# Altium schematic sheet IGNITERS.SchDoc
size 297 x 281 mm; SheetNumber: 6; SheetTotal: 6
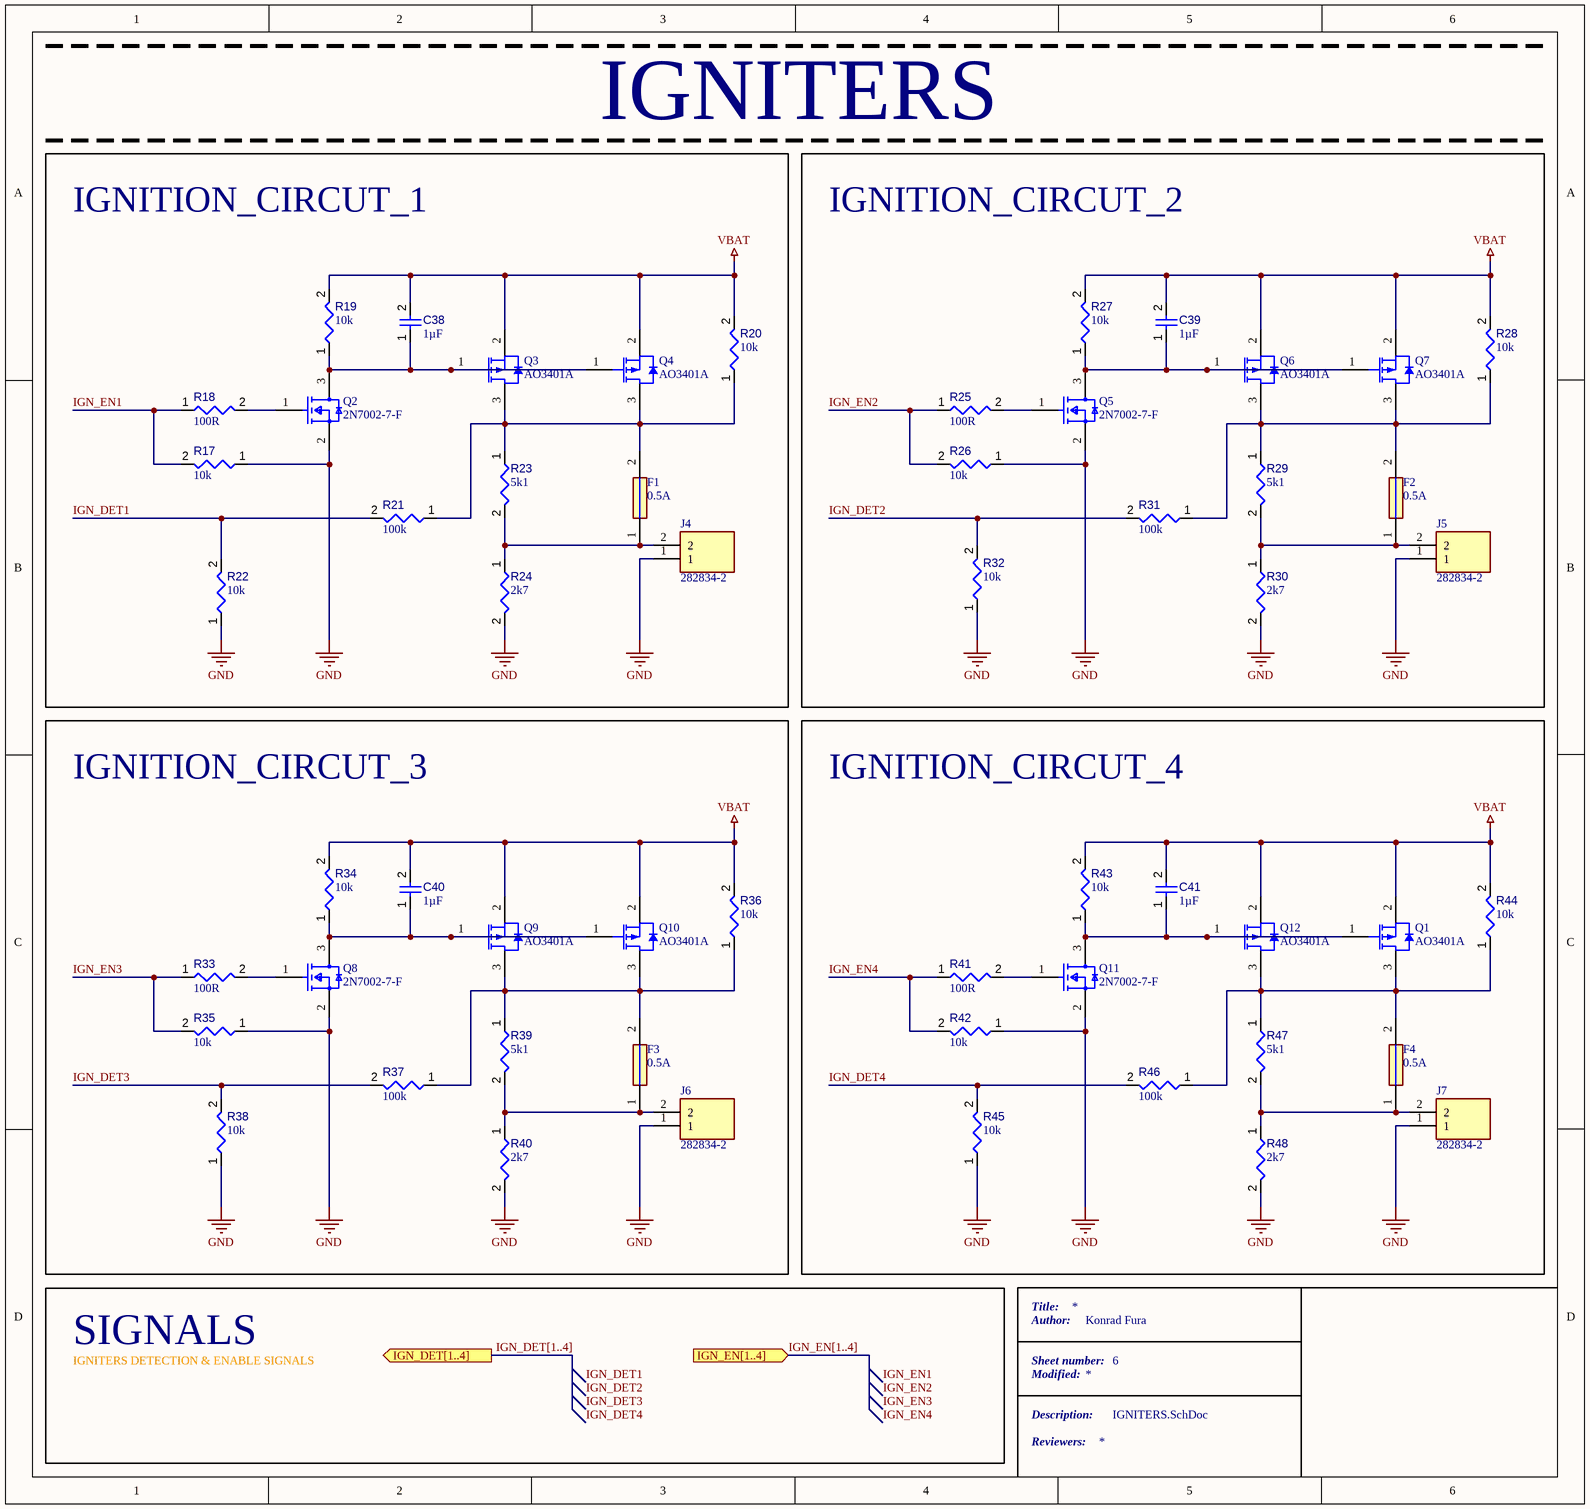
[diagram p0: IGNITERS.SchDoc]

## Parts
C38  value 1µF  [CAPC0402(1005)60_L]  (hidden comment: Capacitor 1µF +/-20% 10V 0402)
C39  value 1µF  [CAPC0402(1005)60_L]  (hidden comment: Capacitor 1µF +/-20% 10V 0402)
C40  value 1µF  [CAPC0402(1005)60_L]  (hidden comment: Capacitor 1µF +/-20% 10V 0402)
C41  value 1µF  [CAPC0402(1005)60_L]  (hidden comment: Capacitor 1µF +/-20% 10V 0402)
F1  0.5A  [FUSC2114X75N]
F2  0.5A  [FUSC2114X75N]
F3  0.5A  [FUSC2114X75N]
F4  0.5A  [FUSC2114X75N]
J4  282834-2  [282834-2_1]
J5  282834-2  [282834-2_1]
J6  282834-2  [282834-2_1]
J7  282834-2  [282834-2_1]
Q1  AO3401A  [AO-SOT-23-3L_V]
Q2  2N7002-7-F  [FP-SOT23-MFG]
Q3  AO3401A  [AO-SOT-23-3L_V]
Q4  AO3401A  [AO-SOT-23-3L_V]
Q5  2N7002-7-F  [FP-SOT23-MFG]
Q6  AO3401A  [AO-SOT-23-3L_V]
Q7  AO3401A  [AO-SOT-23-3L_V]
Q8  2N7002-7-F  [FP-SOT23-MFG]
Q9  AO3401A  [AO-SOT-23-3L_V]
Q10  AO3401A  [AO-SOT-23-3L_V]
Q11  2N7002-7-F  [FP-SOT23-MFG]
Q12  AO3401A  [AO-SOT-23-3L_V]
R17  value 10k  [RESC0402(1005)_L]  (hidden comment: Resistor 10K  +/-1 % 0402 63 mW)
R18  value 100R  [RESC0402(1005)_L]  (hidden comment: Resistor 100R +/-1 % 0402 63 mW)
R19  value 10k  [RESC0402(1005)_L]  (hidden comment: Resistor 10K  +/-1 % 0402 63 mW)
R20  value 10k  [RESC0402(1005)_L]  (hidden comment: Resistor 10K  +/-1 % 0402 63 mW)
R21  value 100k  [RESC0402(1005)_L]  (hidden comment: Resistor 100K +/-1 % 0402 63 mW)
R22  value 10k  [RESC0402(1005)_L]  (hidden comment: Resistor 10K  +/-1 % 0402 63 mW)
R23  value 5k1  [RESC0402(1005)_L]  (hidden comment: Resistor 5.1K +/-1 % 0402 63 mW)
R24  value 2k7  [RESC0402(1005)_L]  (hidden comment: Resistor 2.7K +/-1 % 0402 63 mW)
R25  value 100R  [RESC0402(1005)_L]  (hidden comment: Resistor 100R +/-1 % 0402 63 mW)
R26  value 10k  [RESC0402(1005)_L]  (hidden comment: Resistor 10K  +/-1 % 0402 63 mW)
R27  value 10k  [RESC0402(1005)_L]  (hidden comment: Resistor 10K  +/-1 % 0402 63 mW)
R28  value 10k  [RESC0402(1005)_L]  (hidden comment: Resistor 10K  +/-1 % 0402 63 mW)
R29  value 5k1  [RESC0402(1005)_L]  (hidden comment: Resistor 5.1K +/-1 % 0402 63 mW)
R30  value 2k7  [RESC0402(1005)_L]  (hidden comment: Resistor 2.7K +/-1 % 0402 63 mW)
R31  value 100k  [RESC0402(1005)_L]  (hidden comment: Resistor 100K +/-1 % 0402 63 mW)
R32  value 10k  [RESC0402(1005)_L]  (hidden comment: Resistor 10K  +/-1 % 0402 63 mW)
R33  value 100R  [RESC0402(1005)_L]  (hidden comment: Resistor 100R +/-1 % 0402 63 mW)
R34  value 10k  [RESC0402(1005)_L]  (hidden comment: Resistor 10K  +/-1 % 0402 63 mW)
R35  value 10k  [RESC0402(1005)_L]  (hidden comment: Resistor 10K  +/-1 % 0402 63 mW)
R36  value 10k  [RESC0402(1005)_L]  (hidden comment: Resistor 10K  +/-1 % 0402 63 mW)
R37  value 100k  [RESC0402(1005)_L]  (hidden comment: Resistor 100K +/-1 % 0402 63 mW)
R38  value 10k  [RESC0402(1005)_L]  (hidden comment: Resistor 10K  +/-1 % 0402 63 mW)
R39  value 5k1  [RESC0402(1005)_L]  (hidden comment: Resistor 5.1K +/-1 % 0402 63 mW)
R40  value 2k7  [RESC0402(1005)_L]  (hidden comment: Resistor 2.7K +/-1 % 0402 63 mW)
R41  value 100R  [RESC0402(1005)_L]  (hidden comment: Resistor 100R +/-1 % 0402 63 mW)
R42  value 10k  [RESC0402(1005)_L]  (hidden comment: Resistor 10K  +/-1 % 0402 63 mW)
R43  value 10k  [RESC0402(1005)_L]  (hidden comment: Resistor 10K  +/-1 % 0402 63 mW)
R44  value 10k  [RESC0402(1005)_L]  (hidden comment: Resistor 10K  +/-1 % 0402 63 mW)
R45  value 10k  [RESC0402(1005)_L]  (hidden comment: Resistor 10K  +/-1 % 0402 63 mW)
R46  value 100k  [RESC0402(1005)_L]  (hidden comment: Resistor 100K +/-1 % 0402 63 mW)
R47  value 5k1  [RESC0402(1005)_L]  (hidden comment: Resistor 5.1K +/-1 % 0402 63 mW)
R48  value 2k7  [RESC0402(1005)_L]  (hidden comment: Resistor 2.7K +/-1 % 0402 63 mW)

## Blocks framed on the sheet
IGNITERS: C38 F1 J4 Q2-Q4 R17-R24
IGNITION_CIRCUT_2: C39 F2 J5 Q5-Q7 R25-R32
IGNITION_CIRCUT_3: C40 F3 J6 Q8-Q10 R33-R40
IGNITION_CIRCUT_4: C41 F4 J7 Q1 Q11 Q12 R41-R48

## Ports
IGN_DET[1..4] (out, see SYSTEM_OVERVIEW[3C], MCU[5A]), IGN_EN[1..4] (in, see SYSTEM_OVERVIEW[3C], MCU[5A])

## Nets
GND: J4.1 J5.1 J6.1 J7.1 Q2.2(S) Q5.2(S) Q8.2(S) Q11.2(S) R17.1 R22.1 R24.2 R26.1 R30.2 R32.1 R35.1 R38.1 R40.2 R42.1 R45.1 R48.2
VBAT: C38.2 C39.2 C40.2 C41.2 Q1.2(SOURCE) Q3.2(SOURCE) Q4.2(SOURCE) Q6.2(SOURCE) Q7.2(SOURCE) Q9.2(SOURCE) Q10.2(SOURCE) Q12.2(SOURCE) R19.2 R20.2 R27.2 R28.2 R34.2 R36.2 R43.2 R44.2
IGN_DET1: R21.2 R22.2
IGN_DET2: R31.2 R32.2
IGN_DET3: R37.2 R38.2
IGN_DET4: R45.2 R46.2
IGN_EN1: R17.2 R18.1
IGN_EN2: R25.1 R26.2
IGN_EN3: R33.1 R35.2
IGN_EN4: R41.1 R42.2
NetC38_1: C38.1 Q2.3(D) Q3.1(GATE) Q4.1(GATE) R19.1
NetC39_1: C39.1 Q5.3(D) Q6.1(GATE) Q7.1(GATE) R27.1
NetC40_1: C40.1 Q8.3(D) Q9.1(GATE) Q10.1(GATE) R34.1
NetC41_1: C41.1 Q1.1(GATE) Q11.3(D) Q12.1(GATE) R43.1
NetF1_1: F1.1 J4.2 R23.2 R24.1
NetF1_2: F1.2 Q3.3(DRAIN) Q4.3(DRAIN) R20.1 R21.1 R23.1
NetF2_1: F2.1 J5.2 R29.2 R30.1
NetF2_2: F2.2 Q6.3(DRAIN) Q7.3(DRAIN) R28.1 R29.1 R31.1
NetF3_1: F3.1 J6.2 R39.2 R40.1
NetF3_2: F3.2 Q9.3(DRAIN) Q10.3(DRAIN) R36.1 R37.1 R39.1
NetF4_1: F4.1 J7.2 R47.2 R48.1
NetF4_2: F4.2 Q1.3(DRAIN) Q12.3(DRAIN) R44.1 R46.1 R47.1
NetQ2_1: Q2.1(G) R18.2
NetQ5_1: Q5.1(G) R25.2
NetQ8_1: Q8.1(G) R33.2
NetQ11_1: Q11.1(G) R41.2

## Buses and harness runs
bus IGN_DET[1..4] = port IGN_DET[1..4]
bus IGN_EN[1..4] = port IGN_EN[1..4]

## Notes on the sheet
- IGNITION_CIRCUT_1
- Title:
- Author:
- Konrad Fura
- SIGNALS
- IGNITERS DETECTION & ENABLE SIGNALS
- Sheet number:
- Modified:
- Description:
- Reviewers:
- Labels drawn without touching a wire or pin: IGN_DET1, IGN_DET2, IGN_DET3, IGN_DET4, IGN_EN1, IGN_EN2, IGN_EN3, IGN_EN4

## Library data of the parts
C38-C41 = CMP-001-00063-3: Chip Capacitor, 1µF +/-20%, 10V, 0402, Thickness 0.6 mm; Tolerance: 10%; Mounting Technology: SMT; Max Operating Temperature: 85°C; Voltage Rating: 10V; Pins: 2; Case/Package: 0402; Min Operating Temperature: -55°C
F1-F4 = 0805L020_24YR: Fuse; Manufacturer_Name: LITTELFUSE; Manufacturer_Part_Number: 0805L020/24YR; Datasheet Link: https://m.littelfuse.com/media?resourcetype=datasheets&itemid=3b1fa5dc-24aa-4363-b543-edb057c2fffa&filename=littelfuse-ptc-0805l-datasheet; Height: 0.75mm; Mouser Part Number: 576-0805L020/24YR; Mouser Price/Stock: https://www.mouser.co.uk/ProductDetail/Littelfuse/0805L020-24YR?qs=AQlKX63v8Rtx0r%252BHTgklTQ%3D%3D
J4-J7 = 282834-2: Connector; Manufacturer_Name: TE Connectivity; Datasheet Link: https://www.te.com/commerce/DocumentDelivery/DDEController?Action=srchrtrv&DocNm=1-1773458-1_EURO_STYLE_QRG&DocType=Data+Sheet&DocLang=English&PartCntxt=282834-2&DocFormat=pdf; Manufacturer_Part_Number: 282834-2; Mouser Part Number: 571-282834-2; Mouser Price/Stock: https://www.mouser.co.uk/ProductDetail/TE-Connectivity/282834-2?qs=A%252Bip%252BNCYi6N8cVKuk8xDog%3D%3D; Arrow Part Number: 282834-2; Arrow Price/Stock: https://www.arrow.com/en/products/282834-2/te-connectivity?region=europe
Q1 Q3 Q4 Q6 Q7 Q9 Q10 Q12 = CMP-2000-05778-1: P-Channel MOSFET, 30 V, 4 A, -55 to 150 degC, 3-Pin SOT-23-3L, RoHS, Tape and Reel; Manufacturer: Alpha and Omega; Output Power (Max): NotRequiredW; Power Dissipation: 1.4W; Rad Hardened: No; Drain Efficiency: NotRequired%; Drain-Source On-Volt: 30V; Noise Figure: NotRequireddB; Frequency (Max): NotRequiredMHz; Number of  Elements: 1; Gate-Source Voltage (Max): ?12V; Drain Current (Max): 4A; Channel Mode: Enhancement; Drain-Source On-Res: 0.044ohm; Type: PowerMOSFET; Polarity: P; Package URL: http://www.aosmd.com/res/packaging_information/SOT-23-3L.pdf; Datasheet URL: http://www.aosmd.com/res/data_sheets/AO3401A.pdf; Package Type: SOT-23; Package Description: 3-Pin Small Outline Transistor, Body 2.95 x 1.6 mm, Pitch 0.95 mm; Mounting: SurfaceMount; Manufacturer URL: http://www.aosmd.com/; Continuous Drain Current: 4A; Package Reference: SOT-23-3L; Mounting Technology: SurfaceMount; Operating Temperature Classification: Military; Power Gain: NotRequireddB; Datasheet Version: Rev. 3, 03/2011; Operating Temp Range: -55Cto150C; Pin Count: 3
Q2 Q5 Q8 Q11 = CMP-2000-04929-2: MOSFET N-CH 60V 115MA SOT23-3; Turn-On Delay Time: 7ns; Turn-Off Delay Time: 11ns; Drain to Source Resistance: 7.5R; Rise Time: 3ns; Drain to Source Breakdown Voltage: 70V; Input Capacitance: 50pF; Number of Elements: 1; Power Dissipation: 540mW; Max Power Dissipation: 300mW; Fall Time: 5.6ns; Gate to Source Voltage (Vgs): 20V; Threshold Voltage: 2.5V; Element Configuration: Single; Termination: SMD/SMT; Weight: 0.000282oz; Radiation Hardening: No; Max Operating Temperature: 150°C; On-State Resistance: 7.5R; Mount: Surface Mount; Current Rating: 115mA; Contact Plating: Tin; Lead Free: Lead Free; Min Operating Temperature: -55°C; Number of Pins: 3; REACH SVHC: No SVHC; Drain to Source Voltage (Vdss): 60V; Width: 1.3mm; Package Quantity: 3000; Length: 2.9mm; Case/Package: SOT-23; Number of Channels: 1; Dual Supply Voltage: 60V; Packaging: Tape and Reel; Height: 1mm; Voltage Rating (DC): 60V; Nominal Vgs: 2.5V; Continuous Drain Current (ID): 115mA; Voltage: 60V; Rds On Max: 7.5R
R17 R19 R20 R22 R26-R28 R32 R34-R36 R38 R42-R45 = CMP-009-00149-3: Chip Resistor, 10 kOhms, +/-1 %, 63 mW, -55 to 125 degC, 0402; Power: 63mW; Tolerance: 1%; Min Operating Temperature: -55°C; Case/Package: 0402; Max Operating Temperature: 155°C; Pins: 2
R18 R25 R33 R41 = CMP-009-00167-3: Chip Resistor, 100 Ohms, +/-1 %, 63 mW, -55 to 155 degC, 0402; Power: 63mW; Tolerance: 1%; Min Operating Temperature: -55°C; Case/Package: 0402; Pins: 2; Max Operating Temperature: 155°C
R21 R31 R37 R46 = CMP-009-00168-3: Chip Resistor, 100 kOhms, +/-1 %, 63 mW, -55 to 155 degC, 0402; Tolerance: 1%; Power: 63mW; Max Operating Temperature: 155°C; Min Operating Temperature: -55°C; Pins: 2; Case/Package: 0402
R23 R29 R39 R47 = CMP-009-00168-3: Chip Resistor, 5.1 kOhms, +/-1 %, 63 mW, -55 to 155 degC, 0402; Tolerance: 1%; Power: 63mW; Max Operating Temperature: 155°C; Min Operating Temperature: -55°C; Pins: 2; Case/Package: 0402
R24 R30 R40 R48 = CMP-009-00168-3: Chip Resistor, 2.7 kOhms, +/-1 %, 63 mW, -55 to 155 degC, 0402; Tolerance: 1%; Power: 63mW; Max Operating Temperature: 155°C; Min Operating Temperature: -55°C; Pins: 2; Case/Package: 0402